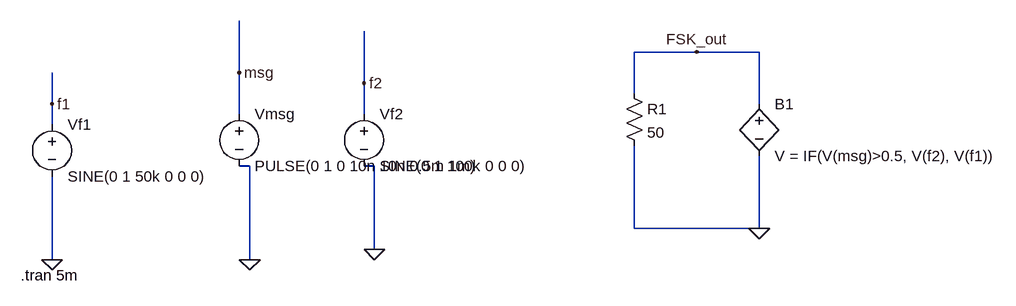
[diagram p0: schematic FTS_FSK.asc]
FTS_FSK.asc, the LTspice schematic file:
Version 4.1
SHEET 1 1588 680
WIRE 1088 -16 992 -16
WIRE 1184 -16 1088 -16
WIRE 384 16 384 -64
WIRE 576 32 576 -48
WIRE 992 48 992 -16
WIRE 96 64 96 16
WIRE 1184 64 1184 -16
WIRE 384 80 384 16
WIRE 576 80 576 32
WIRE 96 96 96 64
WIRE 400 160 384 160
WIRE 592 160 576 160
WIRE 992 256 992 128
WIRE 1184 256 1184 144
WIRE 1184 256 992 256
WIRE 592 288 592 160
WIRE 96 304 96 176
WIRE 400 304 400 160
FLAG 96 304 0
FLAG 96 64 f1
FLAG 592 288 0
FLAG 576 32 f2
FLAG 1184 256 0
FLAG 1088 -16 FSK_out
FLAG 400 304 0
FLAG 384 16 msg
SYMBOL voltage 96 80 R0
WINDOW 123 0 0 Left 0
WINDOW 39 0 0 Left 0
SYMATTR InstName Vf1
SYMATTR Value SINE(0 1 50k 0 0 0)
SYMBOL voltage 576 64 R0
WINDOW 123 0 0 Left 0
WINDOW 39 0 0 Left 0
SYMATTR InstName Vf2
SYMATTR Value SINE(0 1 100k 0 0 0)
SYMBOL bv 1184 48 R0
SYMATTR InstName B1
SYMATTR Value V = IF(V(msg)>0.5, V(f2), V(f1))
SYMBOL res 976 32 R0
SYMATTR InstName R1
SYMATTR Value 50
SYMBOL voltage 384 64 R0
WINDOW 123 0 0 Left 0
WINDOW 39 0 0 Left 0
SYMATTR InstName Vmsg
SYMATTR Value PULSE(0 1 0 10n 10n 0.5m 1m)
TEXT 48 328 Left 2 !.tran 5m

The netlist it stands for:
* FTS_FSK.asc
Vf1 f1 0 SINE(0 1 50k 0 0 0)
Vf2 f2 0 SINE(0 1 100k 0 0 0)
B1 FSK_out 0 V = IF(V(msg)>0.5, V(f2), V(f1))
R1 FSK_out 0 50
Vmsg msg 0 PULSE(0 1 0 10n 10n 0.5m 1m)
.tran 5m
.backanno
.end